# Altium schematic sheet ASIC.SchDoc
size 594 x 420 mm
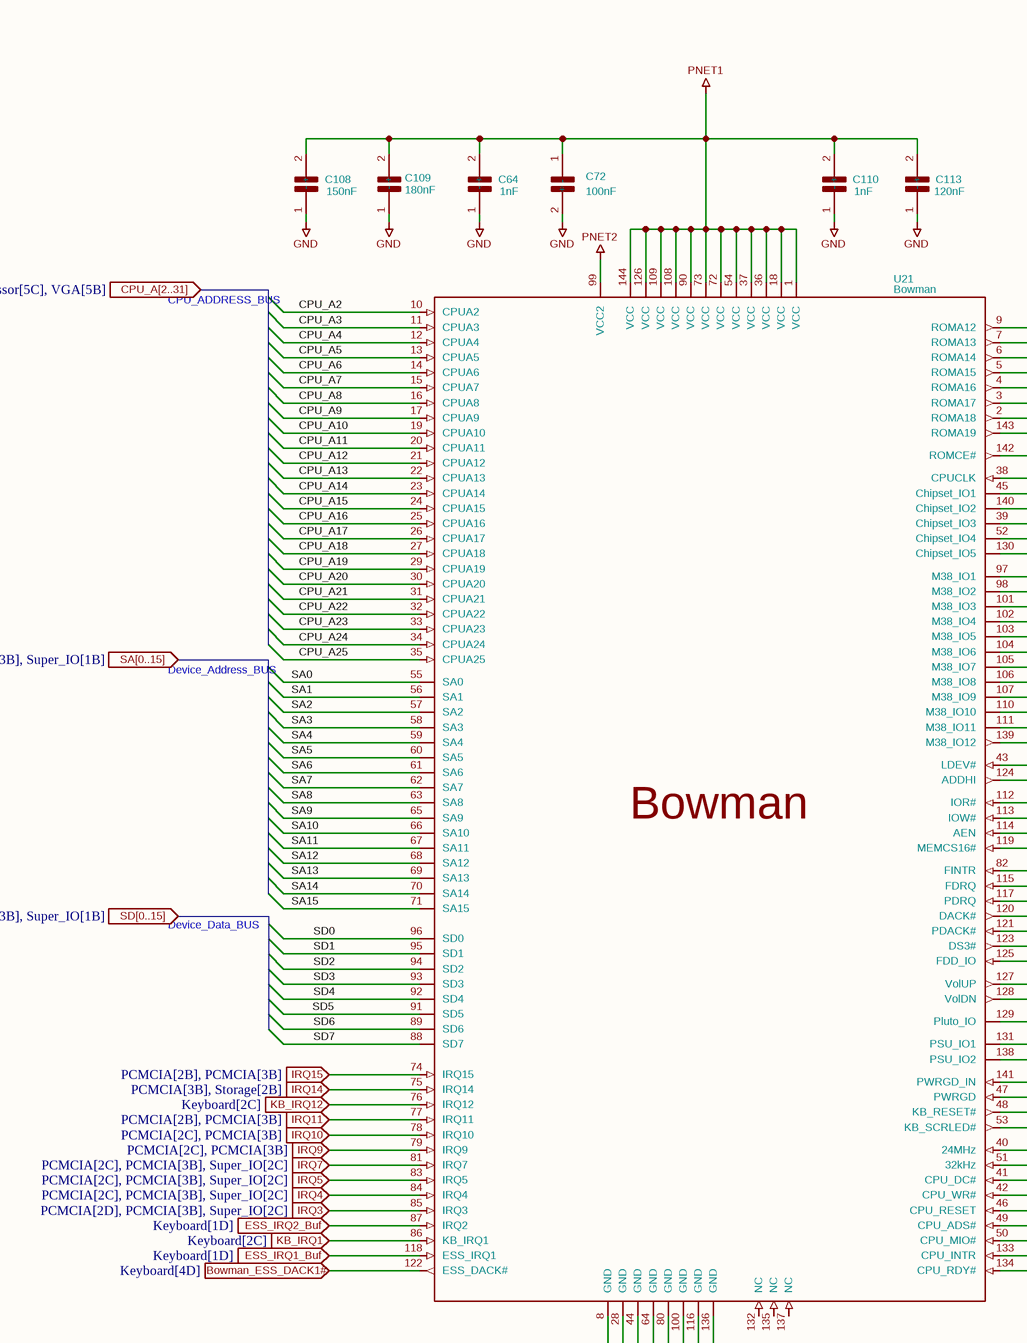
[diagram p0: ASIC.SchDoc, top left]
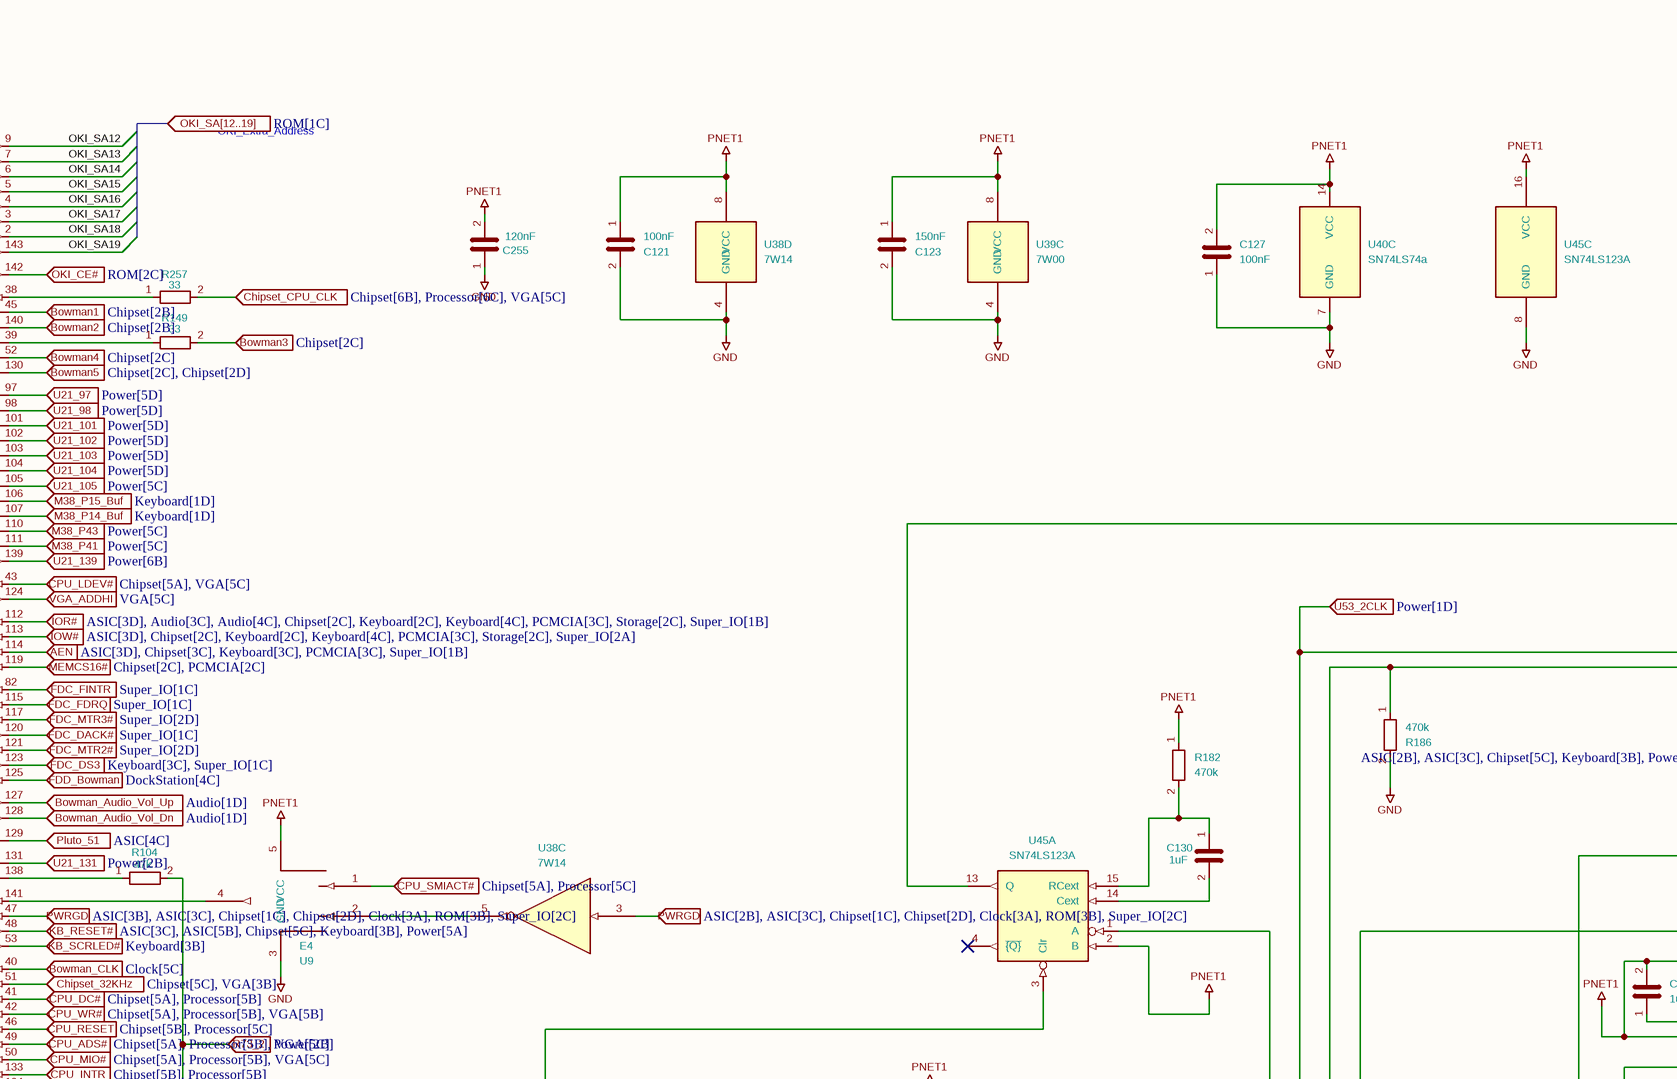
[diagram p1: ASIC.SchDoc, top middle]
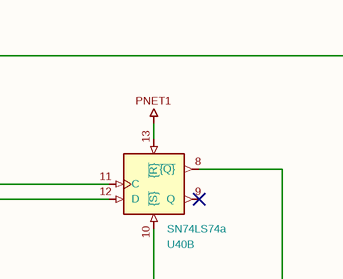
[diagram p2: ASIC.SchDoc, top right]
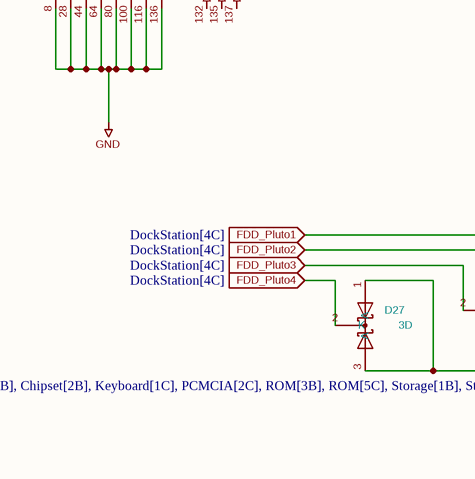
[diagram p3: ASIC.SchDoc, bottom left]
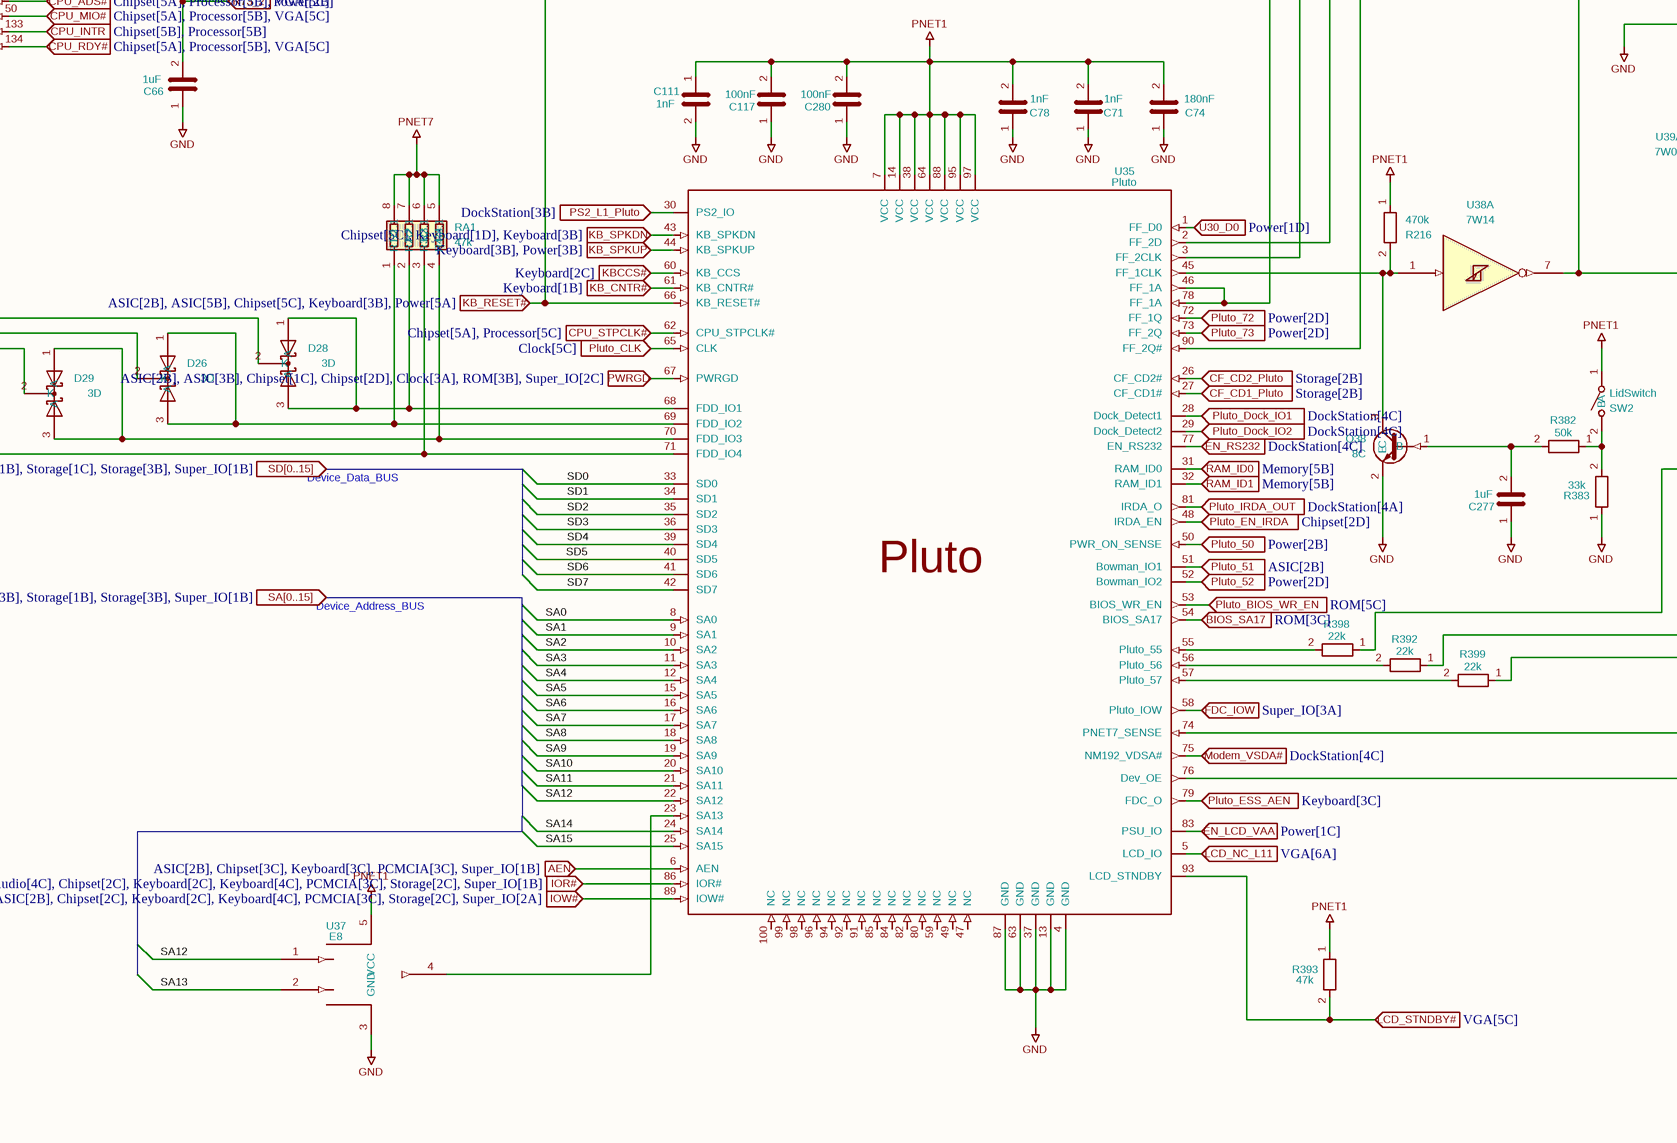
[diagram p4: ASIC.SchDoc, bottom middle]
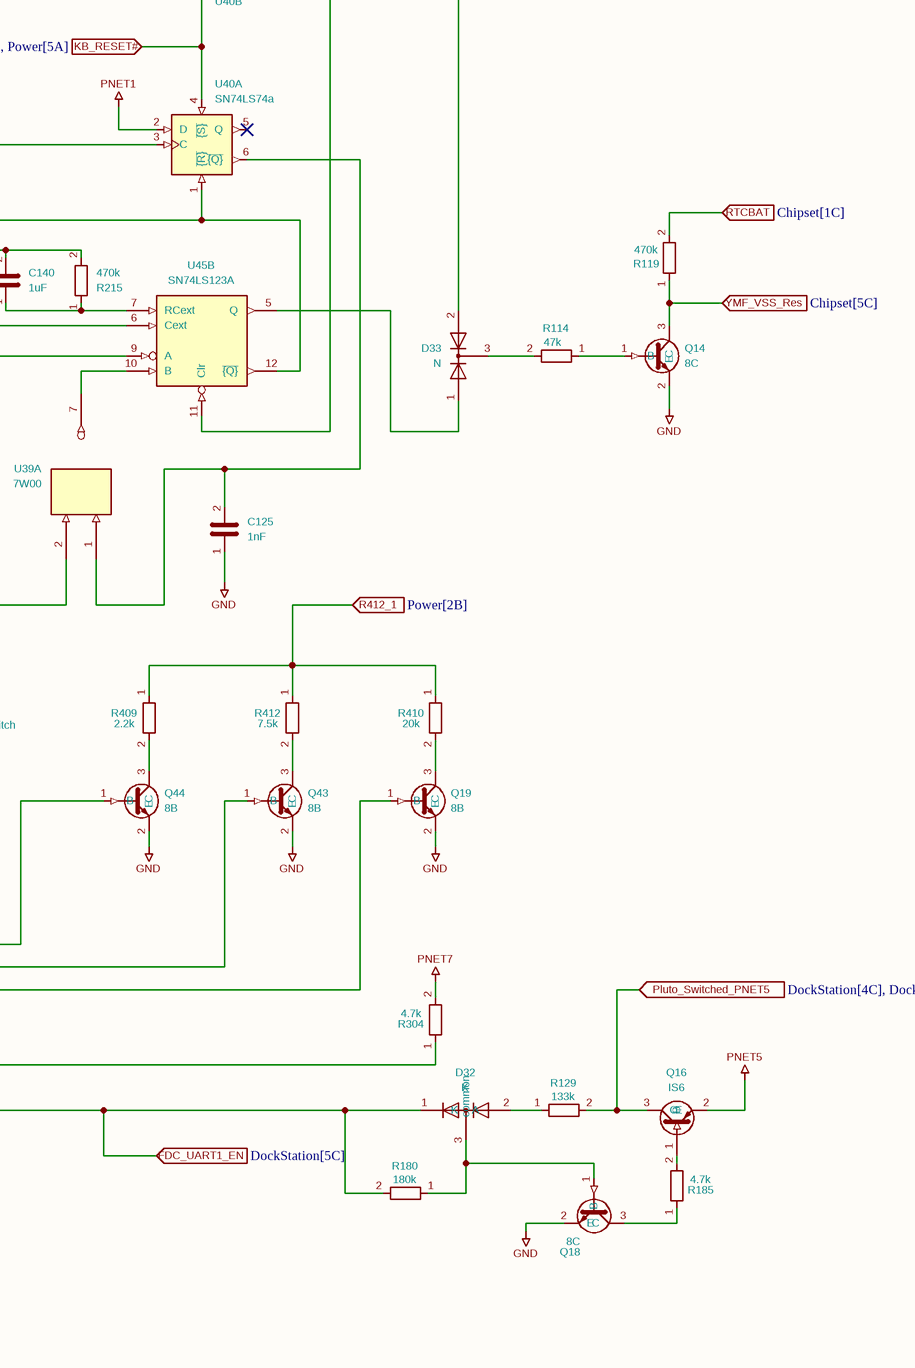
[diagram p5: ASIC.SchDoc, bottom right]

## Parts
C64  1nF  [C_0402_1005Metric]
C66  1uF  [C_0603_1608Metric]
C71  1nF  [C_0402_1005Metric]
C72  100nF  [C_0402_1005Metric]
C74  180nF  [C_0402_1005Metric]
C78  1nF  [C_0402_1005Metric]
C108  150nF  [C_0402_1005Metric]
C109  180nF  [C_0402_1005Metric]
C110  1nF  [C_0402_1005Metric]
C111  1nF  [C_0402_1005Metric]
C113  120nF  [C_0402_1005Metric]
C117  100nF  [C_0402_1005Metric]
C121  100nF  [C_0402_1005Metric]
C123  150nF  [C_0402_1005Metric]
C125  1nF  [C_0402_1005Metric]
C127  100nF  [C_0402_1005Metric]
C130  1uF  [C_0603_1608Metric]
C140  1uF  [C_0603_1608Metric]
C255  120nF  [C_0402_1005Metric]
C277  1uF  [C_0603_1608Metric]
C280  100nF  [C_0402_1005Metric]
D26  3D  [3D]
D27  3D  [3D]
D28  3D  [3D]
D29  3D  [3D]
D32  K  [SOT-416L]
D33  N  [SOT-416]
Q14  8C  [SOT-416]
Q16  IS6  [TSOT-23]
Q18  8C  [SOT-416]
Q19  8B  [SOT-416]
Q38  8C  [SOT-416]
Q43  8B  [SOT-523]
Q44  8B  [SOT-523]
R104  47k  [R_0402_1005Metric]
R114  47k  [R_0402_1005Metric]
R119  470k  [R_0402_1005Metric]
R129  133k  [R_0402_1005Metric]
R149  33  [R_0402_1005Metric]
R180  180k  [R_0402_1005Metric]
R182  470k  [R_0402_1005Metric]
R185  4.7k  [R_0402_1005Metric]
R186  470k  [R_0402_1005Metric]
R215  470k  [R_0402_1005Metric]
R216  470k  [R_0402_1005Metric]
R257  33  [R_0402_1005Metric]
R304  4.7k  [R_0402_1005Metric]
R382  50k  [R_0402_1005Metric]
R383  33k  [R_0402_1005Metric]
R392  22k  [R_0402_1005Metric]
R393  47k  [R_0402_1005Metric]
R398  22k  [R_0402_1005Metric]
R399  22k  [R_0402_1005Metric]
R409  2.2k  [R_0402_1005Metric]
R410  20k  [R_0402_1005Metric]
R412  7.5k  [R_0402_1005Metric]
RA1  47k  [R-array]
SW2  LidSwitch  [LidSwitch]
U9  E4  [SOT-353]
U21  Bowman  [Bowman]
U35  Pluto  [Pluto]
U37  E8  [SOT-353]
U38  7W14  [sso-8]  (parts A,C,D of 4)
U39  7W00  [sso-8]  (parts A,C of 3)
U40  SN74LS74a  [TSSOP-14_4.4x5mm_P0.65mm]  (parts A,B,C of 3)
U45  SN74LS123A  [TSSOP-16_4.4x5mm_P0.65mm]  (parts A,B,C of 3)

## Ports
AEN (in, see ASIC[2B], Chipset[3C], Keyboard[3C], PCMCIA[3C], Super_IO[1B]), AEN (in, see ASIC[3D], Chipset[3C], Keyboard[3C], PCMCIA[3C], Super_IO[1B]), BIOS_SA17 (in, see ROM[3C]), Bowman1 (in, see Chipset[2B]), Bowman2 (in, see Chipset[2B]), Bowman3 (in, see Chipset[2C]), Bowman4 (in, see Chipset[2C]), Bowman5 (in, see Chipset[2C], Chipset[2D]), Bowman_Audio_Vol_Dn (in, see Audio[1D]), Bowman_Audio_Vol_Up (in, see Audio[1D]), Bowman_CLK (in, see Clock[5C]), Bowman_ESS_DACK1# (in, see Keyboard[4D]), CF_CD1_Pluto (in, see Storage[2B]), CF_CD2_Pluto (in, see Storage[2B]), Chipset_32KHz (in, see Chipset[5C], VGA[3B]), Chipset_CPU_CLK (in, see Chipset[6B], Processor[6C], VGA[5C]), CPU_A[2..31] (in, see Chipset[6B], Processor[1B], Processor[5C], VGA[5B]), CPU_ADS# (in, see Chipset[5A], Processor[5B], VGA[5C]), CPU_DC# (in, see Chipset[5A], Processor[5B]), CPU_INTR (in, see Chipset[5B], Processor[5B]), CPU_LDEV# (in, see Chipset[5A], VGA[5C]), CPU_MIO# (in, see Chipset[5A], Processor[5B], VGA[5C]), CPU_RDY# (in, see Chipset[5A], Processor[5B], VGA[5C]), CPU_RESET (in, see Chipset[5B], Processor[5C]), CPU_SMIACT# (in, see Chipset[5A], Processor[5C]), CPU_STPCLK# (in, see Chipset[5A], Processor[5C]), CPU_WR# (in, see Chipset[5A], Processor[5B], VGA[5B]), EN_LCD_VAA (in, see Power[1C]), EN_RS232 (in, see DockStation[4C]), ESS_IRQ1_Buf (in, see Keyboard[1D]), ESS_IRQ2_Buf (in, see Keyboard[1D]), FDC_DACK# (in, see Super_IO[1C]), FDC_DS3 (in, see Keyboard[3C], Super_IO[1C]), FDC_FDRQ (in, see Super_IO[1C]), FDC_FINTR (in, see Super_IO[1C]), FDC_IOW (in, see Super_IO[3A]), FDC_MTR2# (in, see Super_IO[2D]), FDC_MTR3# (in, see Super_IO[2D]), FDC_UART1_EN (in, see DockStation[5C]), FDD_Bowman (in, see DockStation[4C]), FDD_Pluto1 (in, see DockStation[4C]), FDD_Pluto2 (in, see DockStation[4C]), FDD_Pluto3 (in, see DockStation[4C]), FDD_Pluto4 (in, see DockStation[4C]), IOR# (in, see ASIC[2B], Audio[3C], Audio[4C], Chipset[2C], Keyboard[2C], Keyboard[4C], PCMCIA[3C], Storage[2C], Super_IO[1B]), IOR# (in, see ASIC[3D], Audio[3C], Audio[4C], Chipset[2C], Keyboard[2C], Keyboard[4C], PCMCIA[3C], Storage[2C], Super_IO[1B]), IOW# (in, see ASIC[2B], Chipset[2C], Keyboard[2C], Keyboard[4C], PCMCIA[3C], Storage[2C], Super_IO[2A]), IOW# (in, see ASIC[3D], Chipset[2C], Keyboard[2C], Keyboard[4C], PCMCIA[3C], Storage[2C], Super_IO[2A]), IRQ3 (in, see PCMCIA[2D], PCMCIA[3B], Super_IO[2C]), IRQ4 (in, see PCMCIA[2C], PCMCIA[3B], Super_IO[2C]), IRQ5 (in, see PCMCIA[2C], PCMCIA[3B], Super_IO[2C]), IRQ7 (in, see PCMCIA[2C], PCMCIA[3B], Super_IO[2C]), IRQ9 (in, see PCMCIA[2C], PCMCIA[3B]), IRQ10 (in, see PCMCIA[2C], PCMCIA[3B]), IRQ11 (in, see PCMCIA[2B], PCMCIA[3B]), IRQ14 (in, see PCMCIA[3B], Storage[2B]), IRQ15 (in, see PCMCIA[2B], PCMCIA[3B]), KB_CNTR# (in, see Keyboard[1B]), KB_IRQ1 (in, see Keyboard[2C]), KB_IRQ12 (in, see Keyboard[2C]), KB_RESET# (in, see ASIC[2B], ASIC[3C], Chipset[5C], Keyboard[3B], Power[5A]), KB_RESET# (in, see ASIC[2B], ASIC[5B], Chipset[5C], Keyboard[3B], Power[5A]), KB_RESET# (in, see ASIC[3C], ASIC[5B], Chipset[5C], Keyboard[3B], Power[5A]), KB_SCRLED# (in, see Keyboard[3B]), KB_SPKDN (in, see Chipset[5C], Keyboard[1D], Keyboard[3B]), KB_SPKUP (in, see Keyboard[3B], Power[3B]), KBCCS# (in, see Keyboard[2C]), LCD_NC_L11 (in, see VGA[6A]), LCD_STNDBY# (in, see VGA[5C]), M38_P14_Buf (in, see Keyboard[1D]), M38_P15_Buf (in, see Keyboard[1D]), M38_P41 (in, see Power[5C]), M38_P43 (in, see Power[5C]), MEMCS16# (in, see Chipset[2C], PCMCIA[2C]), Modem_VSDA# (in, see DockStation[4C]), OKI_CE# (in, see ROM[2C]), OKI_SA[12..19] (in, see ROM[1C]), Pluto_50 (in, see Power[2B]), Pluto_51 (in, see ASIC[2B]), Pluto_51 (in, see ASIC[4C]), Pluto_52 (in, see Power[2D]), Pluto_72 (in, see Power[2D]), Pluto_73 (in, see Power[2D]), Pluto_BIOS_WR_EN (in, see ROM[5C]), Pluto_CLK (in, see Clock[5C]), Pluto_Dock_IO1 (in, see DockStation[4C]), Pluto_Dock_IO2 (in, see DockStation[4C]), Pluto_EN_IRDA (in, see Chipset[2D]), Pluto_ESS_AEN (in, see Keyboard[3C]), Pluto_IRDA_OUT (in, see DockStation[4A]), Pluto_Switched_PNET5 (in, see DockStation[4C], DockStation[5C]), PS2_L1_Pluto (in, see DockStation[3B]), PWRGD (in, see ASIC[2B], ASIC[3B], Chipset[1C], Chipset[2D], Clock[3A], ROM[3B], Super_IO[2C]), PWRGD (in, see ASIC[2B], ASIC[3C], Chipset[1C], Chipset[2D], Clock[3A], ROM[3B], Super_IO[2C]), PWRGD (in, see ASIC[3B], ASIC[3C], Chipset[1C], Chipset[2D], Clock[3A], ROM[3B], Super_IO[2C]), R73_2 (in, see Power[2B]), R412_1 (in, see Power[2B]), RAM_ID0 (in, see Memory[5B]), RAM_ID1 (in, see Memory[5B]), RTCBAT (in, see Chipset[1C]), SA[0..15] (in, see ASIC[1B], Audio[4B], Chipset[2D], Chipset[6B], Keyboard[1C], PCMCIA[2B], ROM[1B], ROM[3B], Storage[1B], Storage[3B], Super_IO[1B]), SA[0..15] (in, see ASIC[3D], Audio[4B], Chipset[2D], Chipset[6B], Keyboard[1C], PCMCIA[2B], ROM[1B], ROM[3B], Storage[1B], Storage[3B], Super_IO[1B]), SD[0..15] (in, see ASIC[1B], Audio[3B], Chipset[2B], Keyboard[1C], PCMCIA[2C], ROM[3B], ROM[5C], Storage[1B], Storage[1C], Storage[3B], Super_IO[1B]), SD[0..15] (in, see ASIC[3C], Audio[3B], Chipset[2B], Keyboard[1C], PCMCIA[2C], ROM[3B], ROM[5C], Storage[1B], Storage[1C], Storage[3B], Super_IO[1B]), U21_97 (in, see Power[5D]), U21_98 (in, see Power[5D]), U21_101 (in, see Power[5D]), U21_102 (in, see Power[5D]), U21_103 (in, see Power[5D]), U21_104 (in, see Power[5D]), U21_105 (in, see Power[5C]), U21_131 (in, see Power[2B]), U21_139 (in, see Power[6B]), U30_D0 (in, see Power[1D]), U53_2CLK (in, see Power[1D]), VGA_ADDHI (in, see VGA[5C]), YMF_VSS_Res (in, see Chipset[5C])

## Nets
GND: C64.1(+) C66.1 C71.1 C72.2(-) C74.1 C78.1 C108.1(+) C109.1(+) C110.1(+) C111.2 C113.1(+) C117.1 C121.2 C123.2 C125.1 C127.1 C255.1 C277.1 C280.1 Q14.2(E) Q18.2(E) Q19.2(E) Q38.2(E) Q43.2(E) Q44.2(E) R186.2 R383.1 U9.3(GND) U21.8(GND) U21.28(GND) U21.44(GND) U21.64(GND) U21.80(GND) U21.100(GND) U21.116(GND) U21.136(GND) U35.4(GND) U35.13(GND) U35.37(GND) U35.63(GND) U35.87(GND) U37.3(GND) U38.4(GND) U39.4(GND) U40.7(GND) U45.8(GND) U45.9(A)
PNET1: C64.2(-) C71.2 C72.1(+) C74.2 C78.2 C108.2(-) C109.2(-) C110.2(-) C111.1 C113.2(-) C117.2 C121.1 C123.1 C127.2 C140.2 C255.2 C280.2 R182.1 R215.2 R216.1 R393.1 SW2.1(A) U9.5(VCC) U21.1(VCC) U21.18(VCC) U21.36(VCC) U21.37(VCC) U21.54(VCC) U21.72(VCC) U21.73(VCC) U21.90(VCC) U21.108(VCC) U21.109(VCC) U21.126(VCC) U21.144(VCC) U35.7(VCC) U35.14(VCC) U35.38(VCC) U35.64(VCC) U35.88(VCC) U35.95(VCC) U35.97(VCC) U37.5(VCC) U38.8(VCC) U39.8(VCC) U40.2(D) U40.13(~{{R}}) U40.14(VCC) U45.2(B) U45.6(Cext) U45.16(VCC)
PNET2: U21.99(VCC2)
PNET5: Q16.2(E)
PNET7: R304.2 RA1.5(R4.2) RA1.6(R3.2) RA1.7(R2.2) RA1.8(R1.2)
AEN: U21.114(AEN) U35.6(AEN) ; port AEN
BIOS_SA17: U35.54(BIOS_SA17) ; port BIOS_SA17
Bowman1: U21.45(Chipset_IO1) ; port Bowman1
Bowman2: U21.140(Chipset_IO2) ; port Bowman2
Bowman3: R149.2 ; port Bowman3
Bowman4: U21.52(Chipset_IO4) ; port Bowman4
Bowman5: U21.130(Chipset_IO5) ; port Bowman5
Bowman_Audio_Vol_Dn: U21.128(VolDN) ; port Bowman_Audio_Vol_Dn
Bowman_Audio_Vol_Up: U21.127(VolUP) ; port Bowman_Audio_Vol_Up
Bowman_CLK: U21.40(24MHz) ; port Bowman_CLK
Bowman_ESS_DACK1#: U21.122(ESS_DACK#) ; port Bowman_ESS_DACK1#
CF_CD1_Pluto: U35.27(CF_CD1#) ; port CF_CD1_Pluto
CF_CD2_Pluto: U35.26(CF_CD2#) ; port CF_CD2_Pluto
Chipset_32KHz: U21.51(32kHz) ; port Chipset_32KHz
Chipset_CPU_CLK: R257.2 ; port Chipset_CPU_CLK
CPU_A2: U21.10(CPUA2)
CPU_A3: U21.11(CPUA3)
CPU_A4: U21.12(CPUA4)
CPU_A5: U21.13(CPUA5)
CPU_A6: U21.14(CPUA6)
CPU_A7: U21.15(CPUA7)
CPU_A8: U21.16(CPUA8)
CPU_A9: U21.17(CPUA9)
CPU_A10: U21.19(CPUA10)
CPU_A11: U21.20(CPUA11)
CPU_A12: U21.21(CPUA12)
CPU_A13: U21.22(CPUA13)
CPU_A14: U21.23(CPUA14)
CPU_A15: U21.24(CPUA15)
CPU_A16: U21.25(CPUA16)
CPU_A17: U21.26(CPUA17)
CPU_A18: U21.27(CPUA18)
CPU_A19: U21.29(CPUA19)
CPU_A20: U21.30(CPUA20)
CPU_A21: U21.31(CPUA21)
CPU_A22: U21.32(CPUA22)
CPU_A23: U21.33(CPUA23)
CPU_A24: U21.34(CPUA24)
CPU_A25: U21.35(CPUA25)
CPU_ADS#: U21.49(CPU_ADS#) ; port CPU_ADS#
CPU_DC#: U21.41(CPU_DC#) ; port CPU_DC#
CPU_INTR: U21.133(CPU_INTR) ; port CPU_INTR
CPU_LDEV#: U21.43(LDEV#) ; port CPU_LDEV#
CPU_MIO#: U21.50(CPU_MIO#) ; port CPU_MIO#
CPU_RDY#: U21.134(CPU_RDY#) ; port CPU_RDY#
CPU_RESET: U21.46(CPU_RESET) ; port CPU_RESET
CPU_SMIACT#: U9.1 ; port CPU_SMIACT#
CPU_STPCLK#: U35.62(CPU_STPCLK#) ; port CPU_STPCLK#
CPU_WR#: U21.42(CPU_WR#) ; port CPU_WR#
EN_LCD_VAA: U35.83(PSU_IO) ; port EN_LCD_VAA
EN_RS232: U35.77(EN_RS232) ; port EN_RS232
ESS_IRQ1_Buf: U21.118(ESS_IRQ1) ; port ESS_IRQ1_Buf
ESS_IRQ2_Buf: U21.87(IRQ2) ; port ESS_IRQ2_Buf
FDC_DACK#: U21.120(DACK#) ; port FDC_DACK#
FDC_DS3: U21.123(DS3#) ; port FDC_DS3
FDC_FDRQ: U21.115(FDRQ) ; port FDC_FDRQ
FDC_FINTR: U21.82(FINTR) ; port FDC_FINTR
FDC_IOW: U35.58(Pluto_IOW) ; port FDC_IOW
FDC_MTR2#: U21.121(PDACK#) ; port FDC_MTR2#
FDC_MTR3#: U21.117(PDRQ) ; port FDC_MTR3#
FDC_UART1_EN: D32.1(K) R180.2 U35.76(Dev_OE) ; port FDC_UART1_EN
FDD_Bowman: U21.125(FDD_IO) ; port FDD_Bowman
FDD_Pluto1: D28.2(K) ; port FDD_Pluto1
FDD_Pluto2: D26.2(K) ; port FDD_Pluto2
FDD_Pluto3: D29.2(K) ; port FDD_Pluto3
FDD_Pluto4: D27.2(K) ; port FDD_Pluto4
IOR#: U21.112(IOR#) U35.86(IOR#) ; port IOR#
IOW#: U21.113(IOW#) U35.89(IOW#) ; port IOW#
IRQ3: U21.85(IRQ3) ; port IRQ3
IRQ4: U21.84(IRQ4) ; port IRQ4
IRQ5: U21.83(IRQ5) ; port IRQ5
IRQ7: U21.81(IRQ7) ; port IRQ7
IRQ9: U21.79(IRQ9) ; port IRQ9
IRQ10: U21.78(IRQ10) ; port IRQ10
IRQ11: U21.77(IRQ11) ; port IRQ11
IRQ14: U21.75(IRQ14) ; port IRQ14
IRQ15: U21.74(IRQ15) ; port IRQ15
KB_CNTR#: U35.61(KB_CNTR#) ; port KB_CNTR#
KB_IRQ1: U21.86(KB_IRQ1) ; port KB_IRQ1
KB_IRQ12: U21.76(IRQ12) ; port KB_IRQ12
KB_RESET#: U21.48(KB_RESET#) U35.66(KB_RESET#) U40.4(~{{S}}) U40.10(~{{S}}) U45.3(Clr) ; port KB_RESET#
KB_SCRLED#: U21.53(KB_SCRLED#) ; port KB_SCRLED#
KB_SPKDN: U35.43(KB_SPKDN) ; port KB_SPKDN
KB_SPKUP: U35.44(KB_SPKUP) ; port KB_SPKUP
KBCCS#: U35.60(KB_CCS) ; port KBCCS#
LCD_NC_L11: U35.5(LCD_IO) ; port LCD_NC_L11
LCD_STNDBY#: R393.2 U35.93(LCD_STNDBY) ; port LCD_STNDBY#
M38_P14_Buf: U21.107(M38_IO9) ; port M38_P14_Buf
M38_P15_Buf: U21.106(M38_IO8) ; port M38_P15_Buf
M38_P41: U21.111(M38_IO11) ; port M38_P41
M38_P43: U21.110(M38_IO10) ; port M38_P43
MEMCS16#: U21.119(MEMCS16#) ; port MEMCS16#
Modem_VSDA#: U35.75(NM192_VDSA#) ; port Modem_VSDA#
OKI_CE#: U21.142(ROMCE#) ; port OKI_CE#
OKI_SA12: U21.9(ROMA12)
OKI_SA13: U21.7(ROMA13)
OKI_SA14: U21.6(ROMA14)
OKI_SA15: U21.5(ROMA15)
OKI_SA16: U21.4(ROMA16)
OKI_SA17: U21.3(ROMA17)
OKI_SA18: U21.2(ROMA18)
OKI_SA19: U21.143(ROMA19)
Pluto_50: U35.50(PWR_ON_SENSE) ; port Pluto_50
Pluto_51: U21.129(Pluto_IO) U35.51(Bowman_IO1) ; port Pluto_51
Pluto_52: U35.52(Bowman_IO2) ; port Pluto_52
Pluto_72: U35.72(FF_1Q) ; port Pluto_72
Pluto_73: U35.73(FF_2Q) ; port Pluto_73
Pluto_BIOS_WR_EN: U35.53(BIOS_WR_EN) ; port Pluto_BIOS_WR_EN
Pluto_CLK: U35.65(CLK) ; port Pluto_CLK
Pluto_Dock_IO1: U35.28(Dock_Detect1) ; port Pluto_Dock_IO1
Pluto_Dock_IO2: U35.29(Dock_Detect2) ; port Pluto_Dock_IO2
Pluto_EN_IRDA: U35.48(IRDA_EN) ; port Pluto_EN_IRDA
Pluto_ESS_AEN: U35.79(FDC_O) ; port Pluto_ESS_AEN
Pluto_IRDA_OUT: U35.81(IRDA_O) ; port Pluto_IRDA_OUT
Pluto_Switched_PNET5: Q16.3(C) R129.2 ; port Pluto_Switched_PNET5
PS2_L1_Pluto: U35.30(PS2_IO) ; port PS2_L1_Pluto
PWRGD: U21.47(PWRGD) U35.67(PWRGD) U38.3 ; port PWRGD
R73_2: C66.2 R104.2 ; port R73_2
R412_1: R409.1 R410.1 R412.1 ; port R412_1
RAM_ID0: U35.31(RAM_ID0) ; port RAM_ID0
RAM_ID1: U35.32(RAM_ID1) ; port RAM_ID1
RTCBAT: R119.2 ; port RTCBAT
SA0: U21.55(SA0) U35.8(SA0)
SA1: U21.56(SA1) U35.9(SA1)
SA2: U21.57(SA2) U35.10(SA2)
SA3: U21.58(SA3) U35.11(SA3)
SA4: U21.59(SA4) U35.12(SA4)
SA5: U21.60(SA5) U35.15(SA5)
SA6: U21.61(SA6) U35.16(SA6)
SA7: U21.62(SA7) U35.17(SA7)
SA8: U21.63(SA8) U35.18(SA8)
SA9: U21.65(SA9) U35.19(SA9)
SA10: U21.66(SA10) U35.20(SA10)
SA11: U21.67(SA11) U35.21(SA11)
SA12: U21.68(SA12) U35.22(SA12) U37.1
SA13: U21.69(SA13) U37.2
SA14: U21.70(SA14) U35.24(SA14)
SA15: U21.71(SA15) U35.25(SA15)
SD0: U21.96(SD0) U35.33(SD0)
SD1: U21.95(SD1) U35.34(SD1)
SD2: U21.94(SD2) U35.35(SD2)
SD3: U21.93(SD3) U35.36(SD3)
SD4: U21.92(SD4) U35.39(SD4)
SD5: U21.91(SD5) U35.40(SD5)
SD6: U21.89(SD6) U35.41(SD6)
SD7: U21.88(SD7) U35.42(SD7)
U21_97: U21.97(M38_IO1) ; port U21_97
U21_98: U21.98(M38_IO2) ; port U21_98
U21_101: U21.101(M38_IO3) ; port U21_101
U21_102: U21.102(M38_IO4) ; port U21_102
U21_103: U21.103(M38_IO5) ; port U21_103
U21_104: U21.104(M38_IO6) ; port U21_104
U21_105: U21.105(M38_IO7) ; port U21_105
U21_131: U21.131(PSU_IO1) ; port U21_131
U21_139: U21.139(M38_IO12) ; port U21_139
U30_D0: U35.1(FF_D0) ; port U30_D0
U53_2CLK: U35.3(FF_2CLK) U40.11(C) ; port U53_2CLK
VGA_ADDHI: U21.124(ADDHI) ; port VGA_ADDHI
YMF_VSS_Res: Q14.3(C) R119.1 ; port YMF_VSS_Res
NetC125_2: C125.2 U39.1 U40.6(~{{Q}})
NetC130_1: C130.1 R182.2 U45.15(RCext)
NetC130_2: C130.2 U45.14(Cext)
NetC140_1: C140.1 R215.1 U45.7(RCext)
NetC277_2: C277.2 Q38.1(B) R382.2
NetD26_1: D26.1(A) D26.3(A) RA1.1(R1.1) U35.69(FDD_IO2)
NetD27_1: D27.1(A) D27.3(A) RA1.3(R3.1) U35.71(FDD_IO4)
NetD28_1: D28.1(A) D28.3(A) RA1.2(R2.1) U35.68(FDD_IO1)
NetD29_1: D29.1(A) D29.3(A) RA1.4(R4.1) U35.70(FDD_IO3)
NetD32_2: D32.2(A) R129.1
NetD32_3: D32.3(common) Q18.1(B) R180.1
NetD33_1: D33.1 U45.5(Q)
NetD33_2: D33.2 U45.13(Q)
NetD33_3: D33.3 R114.2
NetQ14_1: Q14.1(B) R114.1
NetQ16_1: Q16.1(B) R185.2
NetQ18_3: Q18.3(C) R185.1
NetQ19_1: Q19.1(B) R399.1
NetQ19_3: Q19.3(C) R410.2
NetQ38_3: Q38.3(C) R216.2 U35.45(FF_1CLK) U38.1
NetQ43_1: Q43.1(B) R392.1
NetQ43_3: Q43.3(C) R412.2
NetQ44_1: Q44.1(B) R398.1
NetQ44_3: Q44.3(C) R409.2
NetR104_1: R104.1 U21.138(PSU_IO2)
NetR149_1: R149.1 U21.39(Chipset_IO3)
NetR186_1: R186.1 U35.2(FF_2D) U40.12(D)
NetR257_1: R257.1 U21.38(CPUCLK)
NetR304_1: R304.1 U35.74(PNET7_SENSE)
NetR382_1: R382.1 R383.2 SW2.2(B)
NetR392_2: R392.2 U35.56(Pluto_56)
NetR398_2: R398.2 U35.55(Pluto_55)
NetR399_2: R399.2 U35.57(Pluto_57)
NetU9_2: U9.2 U38.5
NetU9_4: U9.4 U21.141(PWRGD_IN)
NetU35_23: U35.23(SA13) U37.4
NetU35_46: U35.46(FF_1A) U35.78(FF_1A) U45.1(A)
NetU35_90: U35.90(FF_2Q#) U40.1(~{{R}}) U45.12(~{{Q}})
NetU38_7: U38.7 U39.2 U40.3(C)
NetU39_7: U39.7 U45.10(B)
NetU40_8: U40.8(~{{Q}}) U45.11(Clr)

Not connected (* = marked no-connect by the designer): U21 132(NC) 135(NC) 137(NC); U35 47(NC) 49(NC) 59(NC) 80(NC) 82(NC) 84(NC) 85(NC) 91(NC) 92(NC) 94(NC) 96(NC) 98(NC) 99(NC) 100(NC); U40 5(Q)* 9(Q)*; U45 4(~{{Q}})*

## Notes on the sheet
- CPU_ADDRESS_BUS
- OKI_Extra_Address
- Device_Address_BUS
- Device_Data_BUS
- 1
- 2
- 3
- 4
- 5
- 6
- 7
- 8
- 9
- 10
- 11
- A
- B
- C
- D
- E
- F
- G
- H
- Title: PC110
- File: ASIC.kicad_sch
- Sheet: /
- Recreated by: Ahmad Byagowi
- KiCad E.D.A.  kicad (5.1.4)-1
- Size: A2
- Date:
- Rev:
- Id: 1/1

## Library data of the parts
C64 C66 C71 C72 C74 C78 C108-C111 C113 C117 C121 C123 C125 C127 C130 C140 C255 C277 C280 = C
  C64 C71 C78 C110 C111 C125: Value: 1nF; Footprint: Capacitor_SMD:C_0402_1005Metric
  C66 C130 C140 C277: Value: 1uF; Footprint: Capacitor_SMD:C_0603_1608Metric
  C72 C117 C121 C127 C280: Value: 100nF; Footprint: Capacitor_SMD:C_0402_1005Metric
  C74 C109: Value: 180nF; Footprint: Capacitor_SMD:C_0402_1005Metric
  C108 C123: Value: 150nF; Footprint: Capacitor_SMD:C_0402_1005Metric
  C113 C255: Value: 120nF; Footprint: Capacitor_SMD:C_0402_1005Metric
D26-D29 = D_Schottky_Dual_CommonCathode_AKA: Value: 3D; Footprint: PC110:3D
D32 = D_Dual_Series_KAC: Value: K; Footprint: PC110:SOT-416L
D33 = 3D_Diode: Value: N; Footprint: Package_TO_SOT_SMD:SOT-416
Q14 Q18 Q19 Q38 Q43 Q44 = MMBTA44
  Q14 Q18 Q38: Value: 8C; Footprint: Package_TO_SOT_SMD:SOT-416
  Q19: Value: 8B; Footprint: Package_TO_SOT_SMD:SOT-416
  Q43 Q44: Value: 8B; Footprint: Package_TO_SOT_SMD:SOT-523
Q16 = Q_PNP_Generic_BEC: Value: IS6; Footprint: PCM_Package_TO_SOT_SMD_AKL:TSOT-23
R104 R114 R119 R129 R149 R180 R182 R185 R186 R215 R216 R257 R304 R382 R383 R392 R393 R398 R399 R409 R410 R412 = R
  R104 R114: Value: 47k; Footprint: PCM_Resistor_SMD_AKL:R_0402_1005Metric
  R119 R182 R186 R215 R216: Value: 470k; Footprint: PCM_Resistor_SMD_AKL:R_0402_1005Metric
  R129: Value: 133k; Footprint: PCM_Resistor_SMD_AKL:R_0402_1005Metric
  R149: Value: 33; Footprint: PCM_Resistor_SMD_AKL:R_0402_1005Metric
  R180: Value: 180k; Footprint: PCM_Resistor_SMD_AKL:R_0402_1005Metric
  R185: Value: 4.7k; Footprint: PCM_Resistor_SMD_AKL:R_0402_1005Metric
  R257: Value: 33; Footprint: Resistor_SMD:R_0402_1005Metric
  R304: Value: 4.7k; Footprint: Resistor_SMD:R_0402_1005Metric
  R382: Value: 50k; Footprint: Resistor_SMD:R_0402_1005Metric
  R383: Value: 33k; Footprint: Resistor_SMD:R_0402_1005Metric
  R392 R398 R399: Value: 22k; Footprint: Resistor_SMD:R_0402_1005Metric
  R393: Value: 47k; Footprint: Resistor_SMD:R_0402_1005Metric
  R409: Value: 2.2k; Footprint: Resistor_SMD:R_0402_1005Metric
  R410: Value: 20k; Footprint: Resistor_SMD:R_0402_1005Metric
  R412: Value: 7.5k; Footprint: Resistor_SMD:R_0402_1005Metric
RA1 = R_Pack04: Value: 47k; Footprint: PC110:R-array
SW2 = SW_SPST: Value: LidSwitch; Footprint: PC110:LidSwitch
U9 = 74AHC1G32: Value: E4; Footprint: PC110:SOT-353
U37 = 74AHC1G86: Value: E8; Footprint: PC110:SOT-353
U38 = 74LVC3G14: Value: 7W14; Footprint: PC110:sso-8
U39 = 74AHC2G00: Value: 7W00; Footprint: PC110:sso-8
U40 = 74HC74: Value: SN74LS74a; Footprint: Package_SO:TSSOP-14_4.4x5mm_P0.65mm
U45 = 74HC123: Value: SN74LS123A; Footprint: Package_SO:TSSOP-16_4.4x5mm_P0.65mm
U21 = Bowman: Value: Bowman; Footprint: PC110:Bowman
U35 = Pluto: Value: Pluto; Footprint: PC110:Pluto